# Altium schematic sheet LEDMATRIX.SchDoc
size A4; SheetNumber: 1; SheetTotal: 1
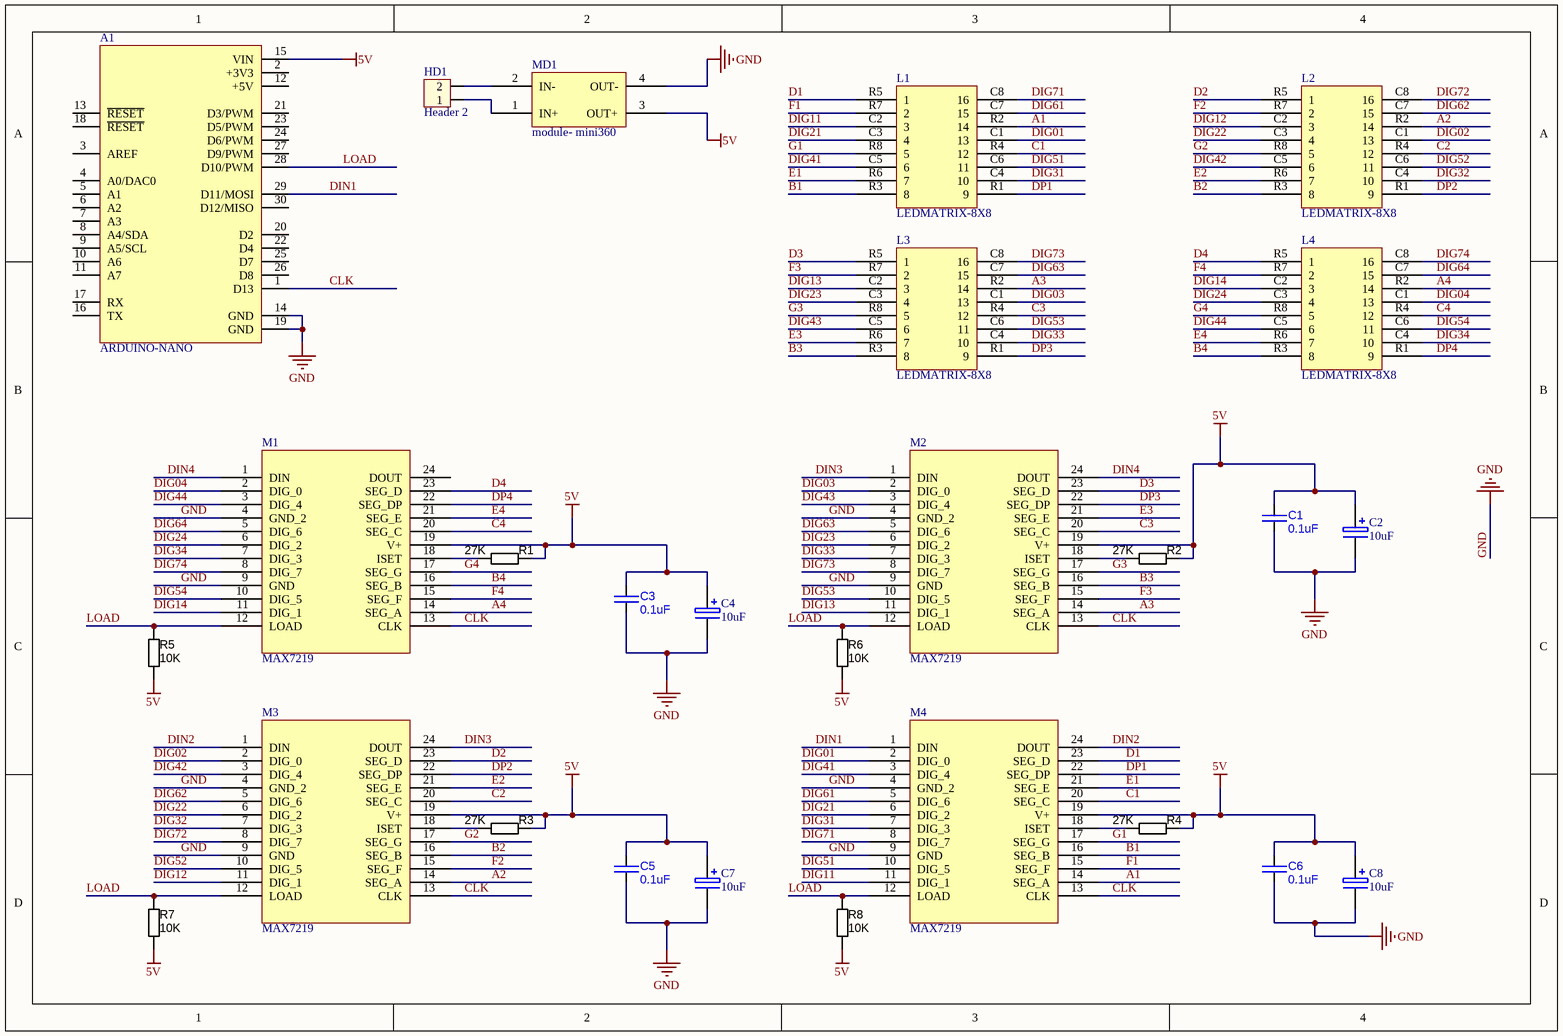
[diagram p0: LEDMATRIX.SchDoc]

## Parts
A1  ARDUINO-NANO  [ARDUINO-NANO]
C1  value 0.1uF  [CAPC2012X135N]  (hidden comment: approved sub OK)
C2  10uF  [CP1/2]
C3  value 0.1uF  [CAPC2012X135N]  (hidden comment: approved sub OK)
C4  10uF  [CP1/2]
C5  value 0.1uF  [CAPC2012X135N]  (hidden comment: approved sub OK)
C6  value 0.1uF  [CAPC2012X135N]  (hidden comment: approved sub OK)
C7  10uF  [CP1/2]
C8  10uF  [CP1/2]
HD1  Header 2  [HED2]
L1  LEDMATRIX-8X8  [LEDMATRIX_8X8]
L2  LEDMATRIX-8X8  [LEDMATRIX_8X8]
L3  LEDMATRIX-8X8  [LEDMATRIX_8X8]
L4  LEDMATRIX-8X8  [LEDMATRIX_8X8]
M1  MAX7219  [MAX7219]
M2  MAX7219  [MAX7219]
M3  MAX7219  [MAX7219]
M4  MAX7219  [MAX7219]
MD1  module- mini360  [MODULE-MINI360]
R1  value 27K  [RESC3216N_ZERO]  (hidden comment: Thick Film)
R2  value 27K  [RESC3216N_ZERO]  (hidden comment: Thick Film)
R3  value 27K  [RESC3216N_ZERO]  (hidden comment: Thick Film)
R4  value 27K  [RESC3216N_ZERO]  (hidden comment: Thick Film)
R5  value 10K  [RESC3216N_ZERO]  (hidden comment: Thick Film)
R6  value 10K  [RESC3216N_ZERO]  (hidden comment: Thick Film)
R7  value 10K  [RESC3216N_ZERO]  (hidden comment: Thick Film)
R8  value 10K  [RESC3216N_ZERO]  (hidden comment: Thick Film)

## Nets
5V: A1.15(VIN) C1.1 C2.1 C3.1 C4.1 C5.1 C6.1 C7.1 C8.1 M1.19(V+) M2.19(V+) M3.19(V+) M4.19(V+) MD1.3(OUT+) R1.2 R2.2 R3.2 R4.2 R5.2 R6.2 R7.2 R8.2
GND: A1.14(GND) A1.19(GND) C1.2 C2.2 C3.2 C4.2 C5.2 C6.2 C7.2 C8.2 M1.4(GND_2) M1.9(GND) M2.4(GND_2) M2.9(GND) M3.4(GND_2) M3.9(GND) M4.4(GND_2) M4.9(GND) MD1.4(OUT-)
A1: L1.R2(14) M4.14(SEG_A)
A2: L2.R2(14) M3.14(SEG_A)
A3: L3.R2(14) M2.14(SEG_A)
A4: L4.R2(14) M1.14(SEG_A)
B1: L1.R3(8) M4.16(SEG_B)
B2: L2.R3(8) M3.16(SEG_B)
B3: L3.R3(8) M2.16(SEG_B)
B4: L4.R3(8) M1.16(SEG_B)
C1: L1.R4(12) M4.20(SEG_C)
C2: L2.R4(12) M3.20(SEG_C)
C3: L3.R4(12) M2.20(SEG_C)
C4: L4.R4(12) M1.20(SEG_C)
CLK: A1.1(D13) M1.13(CLK) M2.13(CLK) M3.13(CLK) M4.13(CLK)
D1: L1.R5(1) M4.23(SEG_D)
D2: L2.R5(1) M3.23(SEG_D)
D3: L3.R5(1) M2.23(SEG_D)
D4: L4.R5(1) M1.23(SEG_D)
DIG01: L1.C1(13) M4.2(DIG_0)
DIG02: L2.C1(13) M3.2(DIG_0)
DIG03: L3.C1(13) M2.2(DIG_0)
DIG04: L4.C1(13) M1.2(DIG_0)
DIG11: L1.C2(3) M4.11(DIG_1)
DIG12: L2.C2(3) M3.11(DIG_1)
DIG13: L3.C2(3) M2.11(DIG_1)
DIG14: L4.C2(3) M1.11(DIG_1)
DIG21: L1.C3(4) M4.6(DIG_2)
DIG22: L2.C3(4) M3.6(DIG_2)
DIG23: L3.C3(4) M2.6(DIG_2)
DIG24: L4.C3(4) M1.6(DIG_2)
DIG31: L1.C4(10) M4.7(DIG_3)
DIG32: L2.C4(10) M3.7(DIG_3)
DIG33: L3.C4(10) M2.7(DIG_3)
DIG34: L4.C4(10) M1.7(DIG_3)
DIG41: L1.C5(6) M4.3(DIG_4)
DIG42: L2.C5(6) M3.3(DIG_4)
DIG43: L3.C5(6) M2.3(DIG_4)
DIG44: L4.C5(6) M1.3(DIG_4)
DIG51: L1.C6(11) M4.10(DIG_5)
DIG52: L2.C6(11) M3.10(DIG_5)
DIG53: L3.C6(11) M2.10(DIG_5)
DIG54: L4.C6(11) M1.10(DIG_5)
DIG61: L1.C7(15) M4.5(DIG_6)
DIG62: L2.C7(15) M3.5(DIG_6)
DIG63: L3.C7(15) M2.5(DIG_6)
DIG64: L4.C7(15) M1.5(DIG_6)
DIG71: L1.C8(16) M4.8(DIG_7)
DIG72: L2.C8(16) M3.8(DIG_7)
DIG73: L3.C8(16) M2.8(DIG_7)
DIG74: L4.C8(16) M1.8(DIG_7)
DIN1: A1.29(D11/MOSI) M4.1(DIN)
DIN2: M3.1(DIN) M4.24(DOUT)
DIN3: M2.1(DIN) M3.24(DOUT)
DIN4: M1.1(DIN) M2.24(DOUT)
DP1: L1.R1(9) M4.22(SEG_DP)
DP2: L2.R1(9) M3.22(SEG_DP)
DP3: L3.R1(9) M2.22(SEG_DP)
DP4: L4.R1(9) M1.22(SEG_DP)
E1: L1.R6(7) M4.21(SEG_E)
E2: L2.R6(7) M3.21(SEG_E)
E3: L3.R6(7) M2.21(SEG_E)
E4: L4.R6(7) M1.21(SEG_E)
F1: L1.R7(2) M4.15(SEG_F)
F2: L2.R7(2) M3.15(SEG_F)
F3: L3.R7(2) M2.15(SEG_F)
F4: L4.R7(2) M1.15(SEG_F)
G1: L1.R8(5) M4.17(SEG_G)
G2: L2.R8(5) M3.17(SEG_G)
G3: L3.R8(5) M2.17(SEG_G)
G4: L4.R8(5) M1.17(SEG_G)
LOAD: A1.28(D10/PWM) M1.12(LOAD) M2.12(LOAD) M3.12(LOAD) M4.12(LOAD) R5.1 R6.1 R7.1 R8.1
NetHD1_1: HD1.1 MD1.1(IN+)
NetHD1_2: HD1.2 MD1.2(IN-)
NetM1_18: M1.18(ISET) R1.1
NetM2_18: M2.18(ISET) R2.1
NetM3_18: M3.18(ISET) R3.1
NetM4_18: M4.18(ISET) R4.1

Not connected (* = marked no-connect by the designer): A1 2(+3V3) 3(AREF) 4(A0/DAC0) 5(A1) 6(A2) 7(A3) 8(A4/SDA) 9(A5/SCL) 10(A6) 11(A7) 12(+5V) 13(~{RESET}) 16(TX) 17(RX) 18(~{RESET}) 20(D2) 21(D3/PWM) 22(D4) 23(D5/PWM) 24(D6/PWM) 25(D7) 26(D8) 27(D9/PWM) 30(D12/MISO); M1 24(DOUT)

## Library data of the parts
C1 C3 C5 C6 = CAP C_0805: Capacitor SMD Cer 1.8nF 10% 50V X7R 0805; Manufacturer 1: AVX Corporation; Manufacturer Part Number 1: 08055C182KAT2A; Ratings: 50V; X7R; SCDType: source*; Tolerance: ±10%; Operating Temperature: -55°C ~ 125°C; Package / Case: 0805 (2012 metric); Supplier 1: Digi-Key; Supplier Part Number 1: 478-1374-1-ND
C2 C4 C7 C8 = CAP hoa: Cap
HD1 = Header 2: Header 2 (Green); Value: Header 2
R1-R8 = RES_1206: Resistor SMD chip 0.0 Ohm 0.25W 1206; Manufacturer 1: Vishay/Dale; Manufacturer Part Number 1: CRCW12060000Z0EA; Tolerance: ±5%; Ratings: 1/4W; SCDType: spec*\?; Package / Case: 1206 (3216 metric); Supplier 1: Digi-Key; Supplier Part Number 1: 541-0.0ECT-ND